# Altium schematic sheet larar6.SchDoc
size 381 x 241 mm; SheetNumber: 1; SheetTotal: 2
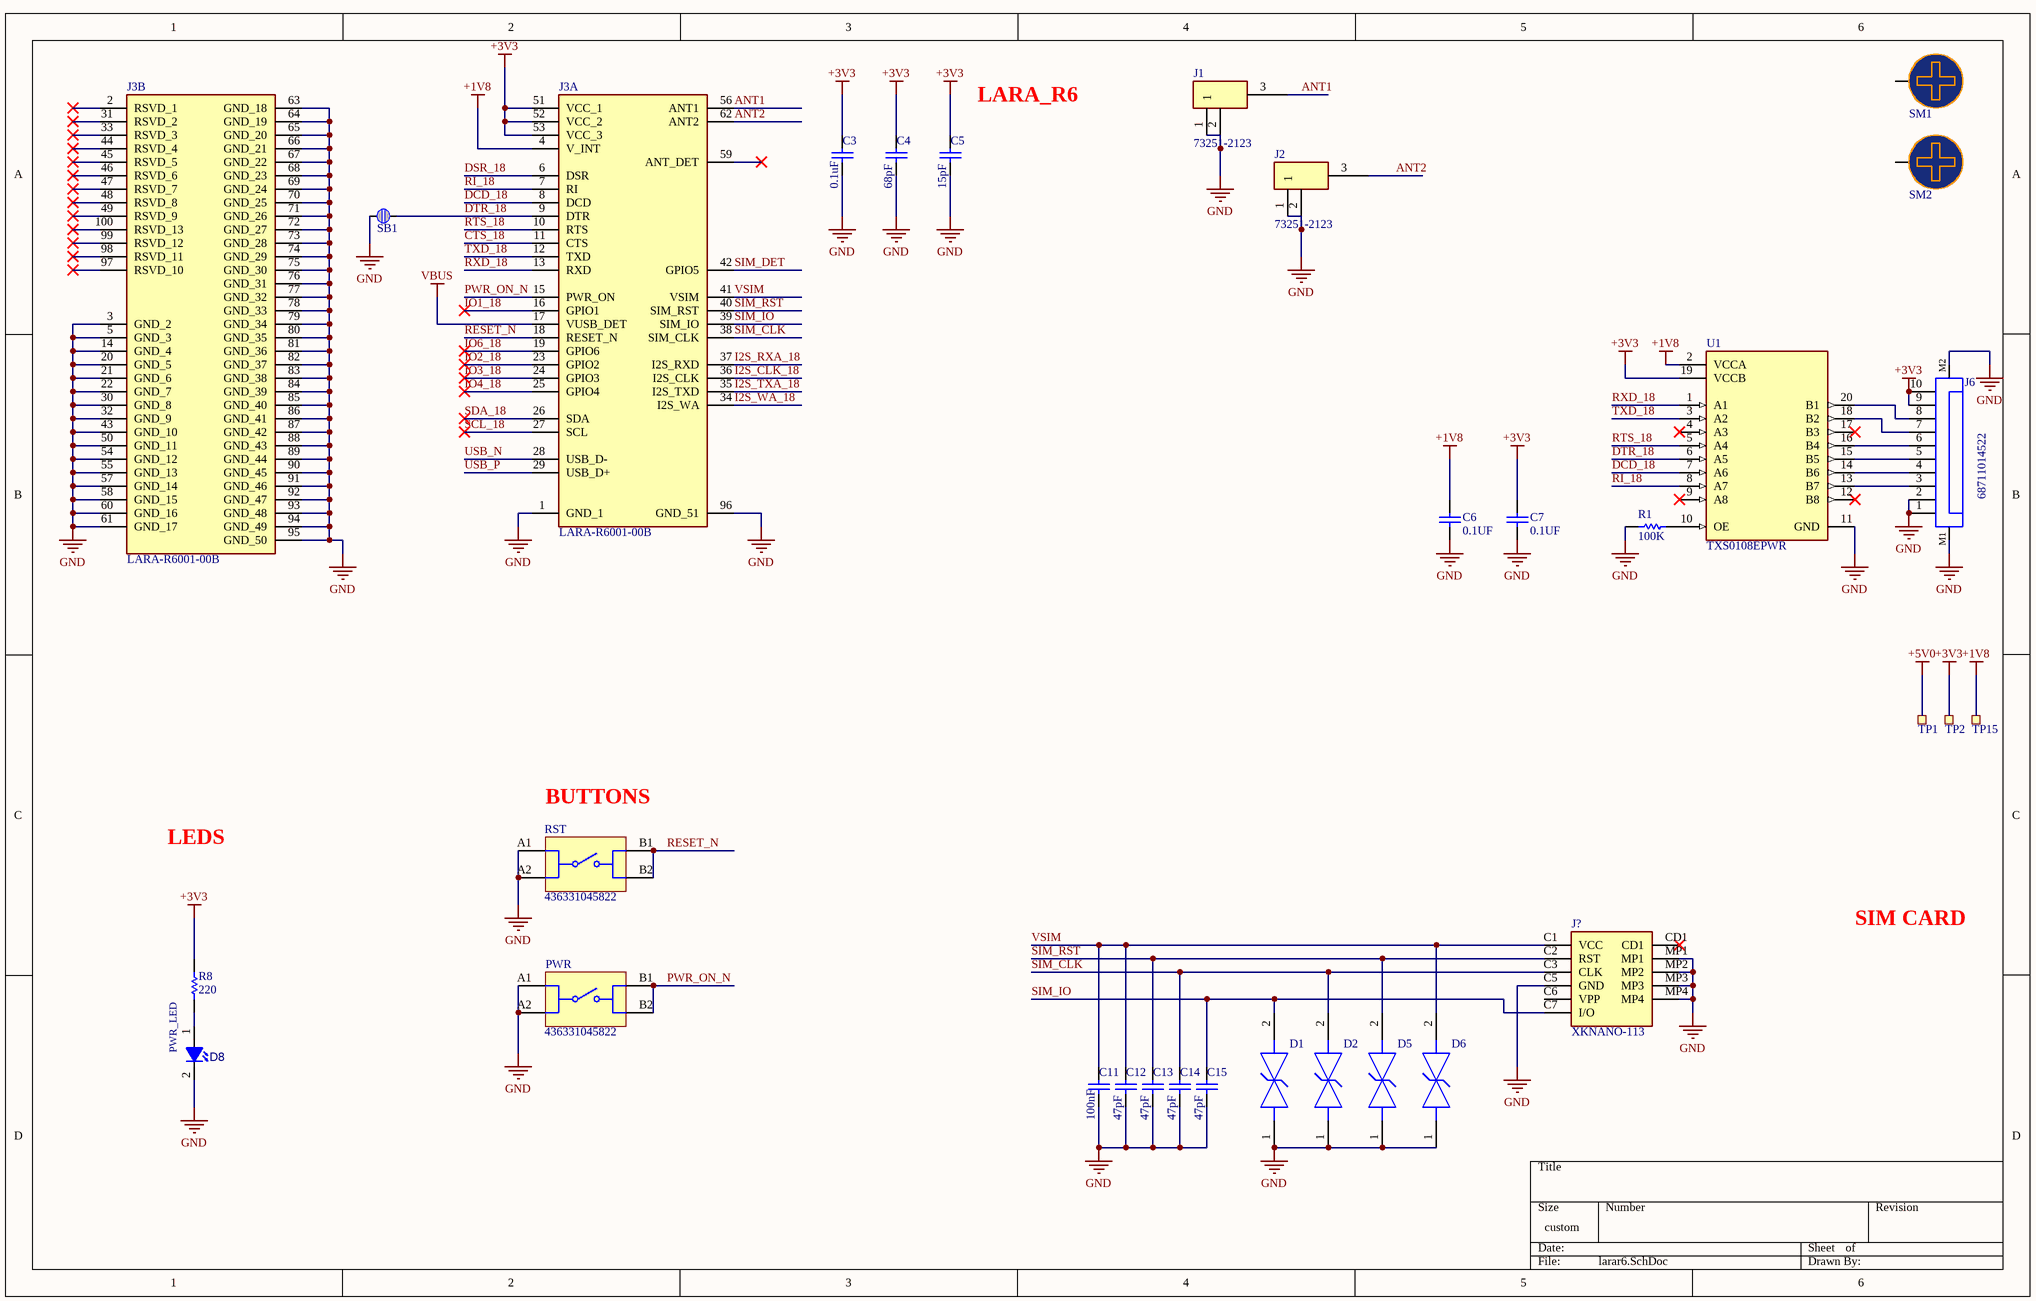
[diagram p0: larar6.SchDoc]

## Parts
C3  0.1uF  [CAP0603]
C4  68pF  [CAP0603]
C5  15pF  [CAP0603]
C6  0.1UF  [CAP0603]
C7  0.1UF  [CAP0603]
C11  100nF  [CAP0603]
C12  47pF  [CAP0603]
C13  47pF  [CAP0603]
C14  47pF  [CAP0603]
C15  47pF  [CAP0603]
D1  PESD0402-140  [FP-PESD0402-MFG]  (value not drawn)
D2  PESD0402-140  [FP-PESD0402-MFG]  (value not drawn)
D5  PESD0402-140  [FP-PESD0402-MFG]  (value not drawn)
D6  PESD0402-140  [FP-PESD0402-MFG]  (value not drawn)
D8  PWR_LED  [LED SMD 0603 (Red)]
J1  73251-2123  [73251-2123]
J2  73251-2123  [73251-2123]
J3  LARA-R6001-00B  [LARAR600100B]  (parts A,B of 2)
J6  68711014522  [68711014522]
J?  XKNANO-113  [XKNANO113]
PWR  436331045822  [436331045822]
R1  100K  [RES0603_(1608X06L)]
R8  220  [RES0603_(1608X06L)]
RST  436331045822  [436331045822]
SB1  SolderBridge  [SB-NO]  (value not drawn)
SM1  Screw M3_1  [Screw-Chsh-M3]  (value not drawn)  (no BOM)
SM2  Screw M3_1  [Screw-Chsh-M3]  (value not drawn)  (no BOM)
TP1  Ø1.5mm,SMD  [TP_SMD_Ø1.5mm]  (value not drawn)  (no BOM)
TP2  Ø1.5mm,SMD  [TP_SMD_Ø1.5mm]  (value not drawn)  (no BOM)
TP15  Ø1.5mm,SMD  [TP_SMD_Ø1.5mm]  (value not drawn)  (no BOM)
U1  TXS0108EPWR  [FP-PW0020A-IPC_C]

## Nets
+1V8: C6.1 J3.4(V_INT) TP15.1 U1.2(VCCA)
+3V3: C3.2 C4.2 C5.2 C7.1 J3.51(VCC_1) J3.52(VCC_2) J3.53(VCC_3) J6.9 J6.10 R8.2 TP2.1 U1.19(VCCB)
+5V0: TP1.1
GND: C3.1 C4.1 C5.1 C6.2 C7.2 C11.1 C12.1 C13.1 C14.1 C15.1 D1.1 D2.1 D5.1 D6.1 D8.2(CATHODE) J1.1 J1.2 J2.1 J2.2 J3.1(GND_1) J3.3(GND_2) J3.5(GND_3) J3.14(GND_4) J3.20(GND_5) J3.21(GND_6) J3.22(GND_7) J3.30(GND_8) J3.32(GND_9) J3.43(GND_10) J3.50(GND_11) J3.54(GND_12) J3.55(GND_13) J3.57(GND_14) J3.58(GND_15) J3.60(GND_16) J3.61(GND_17) J3.63(GND_18) J3.64(GND_19) J3.65(GND_20) J3.66(GND_21) J3.67(GND_22) J3.68(GND_23) J3.69(GND_24) J3.70(GND_25) J3.71(GND_26) J3.72(GND_27) J3.73(GND_28) J3.74(GND_29) J3.75(GND_30) J3.76(GND_31) J3.77(GND_32) J3.78(GND_33) J3.79(GND_34) J3.80(GND_35) J3.81(GND_36) J3.82(GND_37) J3.83(GND_38) J3.84(GND_39) J3.85(GND_40) J3.86(GND_41) J3.87(GND_42) J3.88(GND_43) J3.89(GND_44) J3.90(GND_45) J3.91(GND_46) J3.92(GND_47) J3.93(GND_48) J3.94(GND_49) J3.95(GND_50) J3.96(GND_51) J6.1 J6.2 J6.M1 J6.M2 J?.C5(GND) J?.MP1 J?.MP2 J?.MP3 J?.MP4 PWR.A1 PWR.A2 R1.2 RST.A1 RST.A2 SB1.2 U1.11(GND)
VBUS: J3.17(VUSB_DET)
ANT1: J1.3 J3.56(ANT1)
ANT2: J2.3 J3.62(ANT2)
CTS_18: J3.11(CTS)
DCD_18: J3.8(DCD) U1.7(A6)
DSR_18: J3.6(DSR)
DTR_18: J3.9(DTR) SB1.1 U1.6(A5)
I2S_CLK_18: J3.36(I2S_CLK)
I2S_RXA_18: J3.37(I2S_RXD)
I2S_TXA_18: J3.35(I2S_TXD)
I2S_WA_18: J3.34(I2S_WA)
IO1_18: J3.16(GPIO1)
IO2_18: J3.23(GPIO2)
IO3_18: J3.24(GPIO3)
IO4_18: J3.25(GPIO4)
IO6_18: J3.19(GPIO6)
PWR_ON_N: J3.15(PWR_ON) PWR.B1 PWR.B2
RESET_N: J3.18(RESET_N) RST.B1 RST.B2
RI_18: J3.7(RI) U1.8(A7)
RTS_18: J3.10(RTS) U1.5(A4)
RXD_18: J3.13(RXD) U1.1(A1)
SCL_18: J3.27(SCL)
SDA_18: J3.26(SDA)
SIM_CLK: C14.2 D2.2 J3.38(SIM_CLK) J?.C3(CLK)
SIM_DET: J3.42(GPIO5)
SIM_IO: C15.2 D1.2 J3.39(SIM_IO) J?.C7(I/O)
SIM_RST: C13.2 D5.2 J3.40(SIM_RST) J?.C2(RST)
TXD_18: J3.12(TXD) U1.3(A2)
USB_N: J3.28(USB_D-)
USB_P: J3.29(USB_D+)
VSIM: C11.2 C12.2 D6.2 J3.41(VSIM) J?.C1(VCC)
NetD8_1: D8.1(ANODE) R8.1
NetJ6_3: J6.3 U1.13(B7)
NetJ6_4: J6.4 U1.14(B6)
NetJ6_5: J6.5 U1.15(B5)
NetJ6_6: J6.6 U1.16(B4)
NetJ6_7: J6.7 U1.18(B2)
NetJ6_8: J6.8 U1.20(B1)
NetR1_1: R1.1 U1.10(OE)

Not connected (* = marked no-connect by the designer): J3 2(RSVD_1)* 31(RSVD_2)* 33(RSVD_3)* 44(RSVD_4)* 45(RSVD_5)* 46(RSVD_6)* 47(RSVD_7)* 48(RSVD_8)* 49(RSVD_9)* 59(ANT_DET)* 97(RSVD_10)* 98(RSVD_11)* 99(RSVD_12)* 100(RSVD_13)*; J? C6(VPP) CD1*; SM1 1; SM2 1; U1 4(A3)* 9(A8)* 12(B8)* 17(B3)*

## Notes on the sheet
- (near C5) LARA_R6
- LEDS
- (near RST) BUTTONS
- SIM CARD

## Library data of the parts
C3-C5 C12-C15 = CAP SMD PACKAGE: TOTAL CAPACITOR SMD PACK; Designer: Abbas Basereh; Desc.: CAP SMD TOTAL PACKAGES; VALUE: 100nF; Data: 2017-3-10
C6 C7 = CAP SMD PACKAGE: TOTAL CAPACITOR SMD PACK; Designer: Abbas Basereh; Desc.: CAP SMD TOTAL PACKAGES; VALUE: 100pF; Data: 2017-3-10
C11 = CAP SMD PACKAGE: TOTAL CAPACITOR SMD PACK; Designer: Abbas Basereh; Desc.: CAP SMD TOTAL PACKAGES; Data: 2017-3-10; VALUE: 100nF
D1 D2 D5 D6 = CMP-08607-000011-1: TVS DIODE 14V 40V 0402; Manufacturer: Littelfuse Inc.; Automotive Grade: Grade 1; Capacitance: 0.25pF; Value: 0.25pF; Direction: Bidirectional; Number Of Channels: 1; Temperature Range Low: -55°C; Lead Free: Yes; Temperature: -55°C to +125°C; Digikey Description: TVS DIODE 14V 40V 0402; Automotive: Yes; Device Class L2: TVS Diodes; Reverse Standoff Voltage: 14V; Device Class L1: Circuit Protection; Ipc Land Pattern Name: DIOC10050X33; Manufacturer Part Number: PESD0402-140; Breakdown Voltage: 14V; Height: 0.43mm; Clamping Voltage: 40V; RoHS: TRUE; Temperature Range High: +125°C; Device Class L3: unset; Octopart: https://octopart.com/pesd0402-140-littelfuse-74215061; Package: PESD0402; ComponentLink2URL: https://www.littelfuse.com/~/media/electronics/datasheets/polymer_esd_suppressors/littelfuse_polymer_esd_suppressor_pesd_catalog_datasheet.pdf.pdf; Category: Diode; ComponentLink2Description: Datasheet
D8 = LED SMD 0603: ComponentLink1Description: Tarahiboard; ComponentLink1URL: https://www.tarahiboard.com/product/library-pack; DatasheetVersion: 2022
J1 J2 = 73251-2123: Connector; Manufacturer_Name: Molex; Manufacturer_Part_Number: 73251-2123; Mouser Part Number: 538-73251-2123; Mouser Price/Stock: https://www.mouser.co.uk/ProductDetail/Molex/73251-2123?qs=KpdAywxU010iaT6kySWldg%3D%3D
J3 = LARA-R6001-00B: Connector; Manufacturer_Name: u-blox; Datasheet Link: https://content.u-blox.com/sites/default/files/LARA-R6_DataSheet_UBX-21004391.pdf; Height: 2.87mm; Manufacturer_Part_Number: LARA-R6001-00B; Mouser Part Number: 377-LARA-R6001-00B; Mouser Price/Stock: https://www.mouser.co.uk/ProductDetail/u-blox/LARA-R6001-00B?qs=Li%252BoUPsLEnu1nGRnflMQjg%3D%3D
J6 = CMP-1502-01529-2: NexarPartId: 8917690; Contact Location: Bottom; Number of Positions: 10; Current Rating: 500mA; Pitch: 500µm; Voltage Rating: 50V; Contact Resistance: 20mΩ; Gender: Male; Insulation Resistance: 100MΩ; Actuator Material: Liquid Crystal Polymer, Polymer; Number of Rows: 1; Orientation: Horizontal; Max Operating Temperature: 85°C; Flammability Rating: UL94 V-0; Packaging: Tape and Reel; Housing Material: Liquid Crystal Polymer; Termination: SMD/SMT; Height: 2.25mm; REACH SVHC: Unknown; Number of Pins: 10; Lead Pitch: 500µm; Contact Plating: Tin; Mount: Surface Mount; Contact Material: Tin; Length: 11.4mm; RoHS: Compliant; Operating Supply Voltage: 50V; Min Operating Temperature: -25°C; Width: 2.1mm; Number of Contacts: 10
J? = XKNANO-113: Connector; Manufacturer_Name: XKB Connectivity; Datasheet Link: https://datasheet.lcsc.com/lcsc/2110151630_XKB-Connectivity-XKNANO-113_C381071.pdf; Height: 1.57mm; Manufacturer_Part_Number: XKNANO-113
PWR RST = CMP-1463-00001-3: NexarPartId: 22862795; Contact Current Rating: 50mA; Contact Resistance: 100mΩ; Voltage Rating: 12V; Life (Cycles): 100kcycles; Max Operating Temperature: 85°C; Mount: Surface Mount; Height: 1.65mm; RoHS: Compliant; Contact Plating: Silver; Min Operating Temperature: -40°C; Voltage Rating (DC): 12V; Current Rating: 50mA; Insulation Resistance: 100MΩ; Packaging: Tape and Reel; Width: 4.7mm
R1 R8 = RES SMD PACKAGE: TOTAL SMD RESISTOR PACK; Designer: Abbas Basereh; Desc.: RES SMD PAKAGES; Data: 2017-3-10
SM1 SM2 = Screw M3_1: Screw, hole diameter 3.2mm & 3.7mm, PanHead 5mm & 5.6mm & 6mm & 7mm; ComponentLink1Description: Website: Tarahiboard; ComponentLink1URL: https://www.tarahiboard.com/product/library-pack; DatasheetVersion: 2022
TP1 TP2 TP15 = TP_SMD_Ø1.5MM: 1.5mm circular SMD testpad; Manufacturer: Nordic Semiconductor; Manufacturer Part Number: N.A.; Pad Count: 1; Part Number: TP_SMD_Ø1.5MM; LatestRevisionDate: 2016-06-02; Published: 2016-06-02; Value: Ø1.5mm,SMD; Note: N.A.; Artikkelnr Noca: N.A.; Footprint Doc: TP_SMD_Ø1.5mm; Part number IPS: N.A.; ComponentLink1URL: N.A.; ComponentLink1Description: Datasheet; ComponentLink2URL: N.A.; ComponentLink2Description: Supplier link; HelpURL: N.A.; Supplier 1: N.A.; Supplier Part Number 1: N.A.; Supplier 2: N.A.; Supplier Part Number 2: N.A.; Component Class: Connectors; PartId: 100500477
U1 = CMP-2000-04956-2: IC TRNSLTR BIDIRECTIONAL 20TSSOP; Number of Inputs: 8; Supply Current: 8uA; Low Level Output Current: 50mA; Min Supply Voltage: 1.2V; Quiescent Current: 3uA; Output Type: Voltage; Propagation Delay: 4.8ns; Max Supply Voltage: 5.5V; Output Current: 620uA; Turn-On Delay Time: 312ns; Logic Function: Translator; Data Rate: 60Mbps; Rise Time: 6.3ns; High Level Output Current: -50mA; Number of Pins: 20; Packaging: Tape and Reel; Max Operating Temperature: 85°C; Height: 1.15mm; Nominal Supply Current: 8uA; Termination: SMD/SMT; Lead Free: Lead Free; Package Quantity: 1; Number of Bits: 8; Weight: 0.002716oz; Contact Plating: Gold; Series: -; Width: 4.4mm; Radiation Hardening: No; Mount: Surface Mount; Length: 6.5mm; Case/Package: TSSOP; REACH SVHC: No SVHC; RoHS Compliant: Yes; Min Operating Temperature: -40°C; Number of Channels: 8